# Altium schematic sheet MCU.SchDoc
size A; SheetNumber: 1; SheetTotal: 5
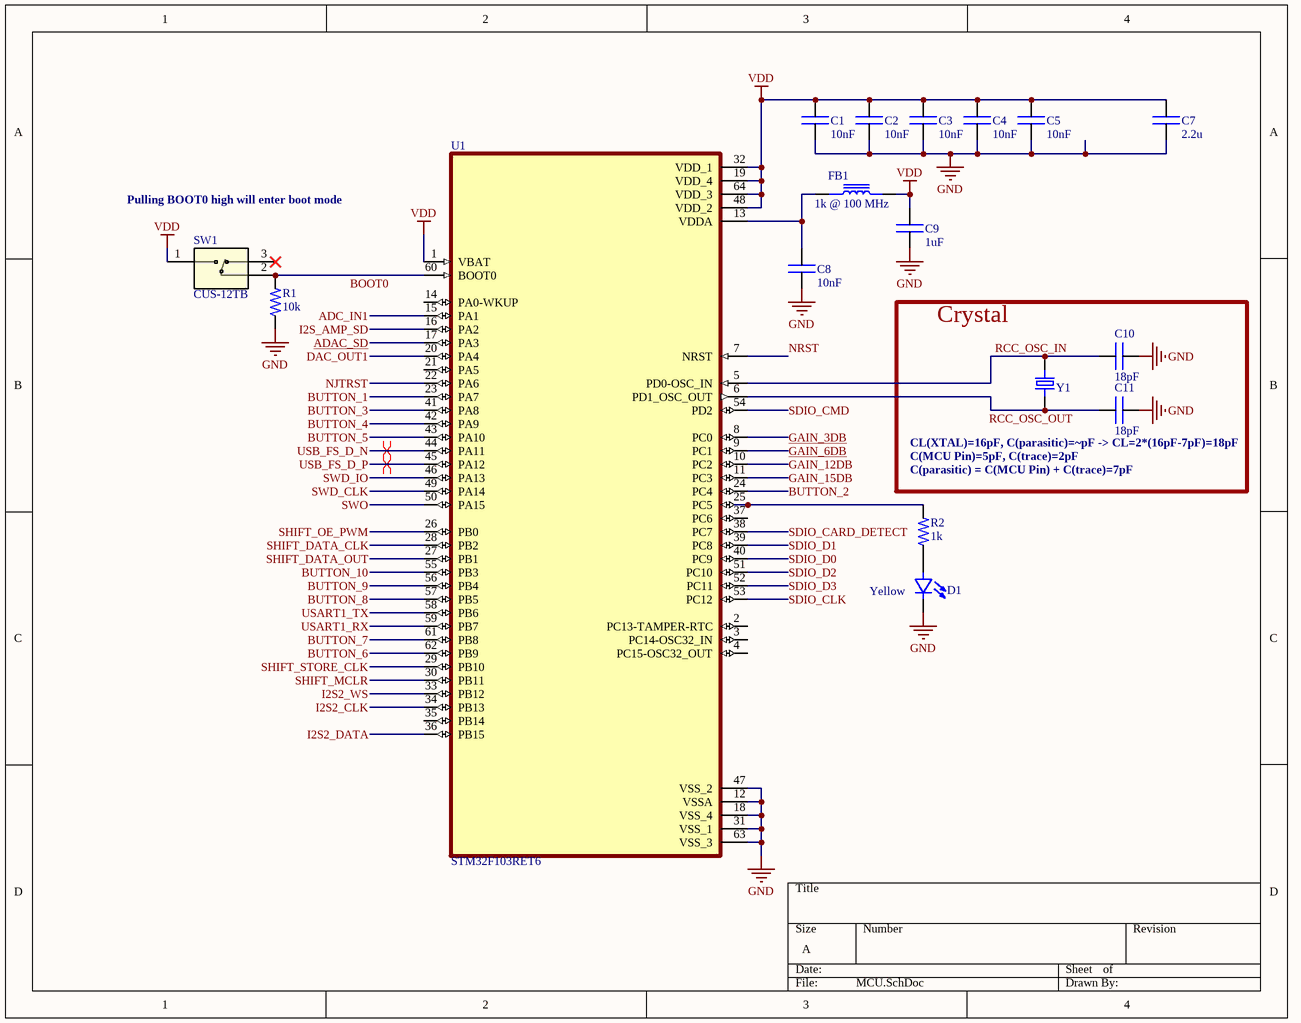
[diagram p0: MCU.SchDoc]

## Parts
C1  value 10nF  [0603-CAP]  (hidden comment: CAP)
C2  value 10nF  [0603-CAP]  (hidden comment: CAP)
C3  value 10nF  [0603-CAP]  (hidden comment: CAP)
C4  value 10nF  [0603-CAP]  (hidden comment: CAP)
C5  value 10nF  [0603-CAP]  (hidden comment: CAP)
C7  value 2.2u  [0603-CAP]  (hidden comment: CAP)
C8  value 10nF  [0603-CAP]  (hidden comment: CAP)
C9  value 1uF  [0603-CAP]  (hidden comment: CAP)
C10  value 18pF  [0603-CAP]  (hidden comment: CAP)
C11  value 18pF  [0603-CAP]  (hidden comment: CAP)
D1  Color: Yellow  [0603-LED]  (hidden comment: LED - single)
FB1  1k @ 100 MHz  [0603-FB]
R1  value 10k  [0603-RES]  (hidden comment: RES)
R2  value 1k  [0603-RES]  (hidden comment: RES)
SW1  CUS-12TB  [SSSS811101]
U1  STM32F103RET6  [LQFP-64]
Y1  SX5B12.000F1620F30  [SMD5032-4P]  (value not drawn)

## Blocks framed on the sheet
Crystal: C10 C11 Y1

## Nets
GND: C1.1 C2.1 C3.1 C4.1 C5.1 C7.1 C8.1 C9.1 C10.2 C11.2 D1.2(C) R1.1 U1.12(VSSA) U1.18(VSS_4) U1.31(VSS_1) U1.47(VSS_2) U1.63(VSS_3)
VDD: C1.2 C2.2 C3.2 C4.2 C5.2 C7.2 C9.2 FB1.2 SW1.1 U1.1(VBAT) U1.19(VDD_4) U1.32(VDD_1) U1.48(VDD_2) U1.64(VDD_3)
ADAC_SD: U1.17(PA3)
ADC_IN1: U1.15(PA1)
BOOT0: R1.2 SW1.2 U1.60(BOOT0)
BUTTON_1: U1.23(PA7)
BUTTON_2: U1.24(PC4)
BUTTON_3: U1.41(PA8)
BUTTON_4: U1.42(PA9)
BUTTON_5: U1.43(PA10)
BUTTON_6: U1.62(PB9)
BUTTON_7: U1.61(PB8)
BUTTON_8: U1.57(PB5)
BUTTON_9: U1.56(PB4)
BUTTON_10: U1.55(PB3)
DAC_OUT1: U1.20(PA4)
GAIN_3DB: U1.8(PC0)
GAIN_6DB: U1.9(PC1)
GAIN_12DB: U1.10(PC2)
GAIN_15DB: U1.11(PC3)
I2S2_CLK: U1.34(PB13)
I2S2_DATA: U1.36(PB15)
I2S2_WS: U1.33(PB12)
I2S_AMP_SD: U1.16(PA2)
NJTRST: U1.22(PA6)
NRST: U1.7(NRST)
RCC_OSC_IN: C10.1 U1.5(PD0-OSC_IN) Y1.1
RCC_OSC_OUT: C11.1 U1.6(PD1_OSC_OUT) Y1.2
SDIO_CARD_DETECT: U1.38(PC7)
SDIO_CLK: U1.53(PC12)
SDIO_CMD: U1.54(PD2)
SDIO_D0: U1.40(PC9)
SDIO_D1: U1.39(PC8)
SDIO_D2: U1.51(PC10)
SDIO_D3: U1.52(PC11)
SHIFT_DATA_CLK: U1.28(PB2)
SHIFT_DATA_OUT: U1.27(PB1)
SHIFT_MCLR: U1.30(PB11)
SHIFT_OE_PWM: U1.26(PB0)
SHIFT_STORE_CLK: U1.29(PB10)
SWD_CLK: U1.49(PA14)
SWD_IO: U1.46(PA13)
SWO: U1.50(PA15)
USART1_RX: U1.59(PB7)
USART1_TX: U1.58(PB6)
USB_FS_D_N: U1.44(PA11)
USB_FS_D_P: U1.45(PA12)
NetC8_2: C8.2 FB1.1 U1.13(VDDA)
NetD1_1: D1.1(A) R2.1
NetR2_2: R2.2 U1.25(PC5)

Not connected (* = marked no-connect by the designer): SW1 3*; U1 2(PC13-TAMPER-RTC) 3(PC14-OSC32_IN) 4(PC15-OSC32_OUT) 14(PA0-WKUP) 21(PA5) 35(PB14) 37(PC6)

## Layout directives
differential pair; differential pair class DIFF_USB: USB_FS_D_N, USB_FS_D_P

## Notes on the sheet
- Pulling BOOT0 high will enter boot mode
- CL(XTAL)=16pF, C(parasitic)=~pF -> CL=2*(16pF-7pF)=18pF
- C(MCU Pin)=5pF, C(trace)=2pF
- C(parasitic) = C(MCU Pin) + C(trace)=7pF

## Library data of the parts
C1-C5 C7-C11 = CAP: Capaicitor; Type: SMD; MFR: *; MFR PN: *
D1 = LED - single: LED; MFR: MEIHUA; MFR PN: MHT192WDT-GOLD; Type: SMD
FB1 = FERRITE BEAD: MFR: TDK; MFR PN: MMZ1608Y102BTD25; Type: SMD
R1 R2 = RES: Resistor; MFR PN: *; MFR: *; Type: SMD
SW1 = SPDT SLIDE SWITCH: JLC Alternate: / SSSS811101; MFR: ALPSALPINE; MFR PN: SSSS811101; Type: SMD
U1 = STM32F103RET6: STM32F103RET6, 32 bit ARM Cortex M3 Microcontroller 72MHz 256 kB Flash, 48 kB RAM, USB CAN I2C 64-Pin LQFP; MFR: STMicroelectronics; MFR PN: STM32F103RET6; Type: SMD
Y1 = XTAL-OSC_JLC: SMD Tuning Fork Crystal; MFR: Shenzhen SCTF Elec; Frequency: 12MHz; MFR PN: SX5B12.000F1620F30; Type: SMD; JLC PN: C2901628